# EAGLE design Power_ToOctoPi (EAGLE 8.4.0)
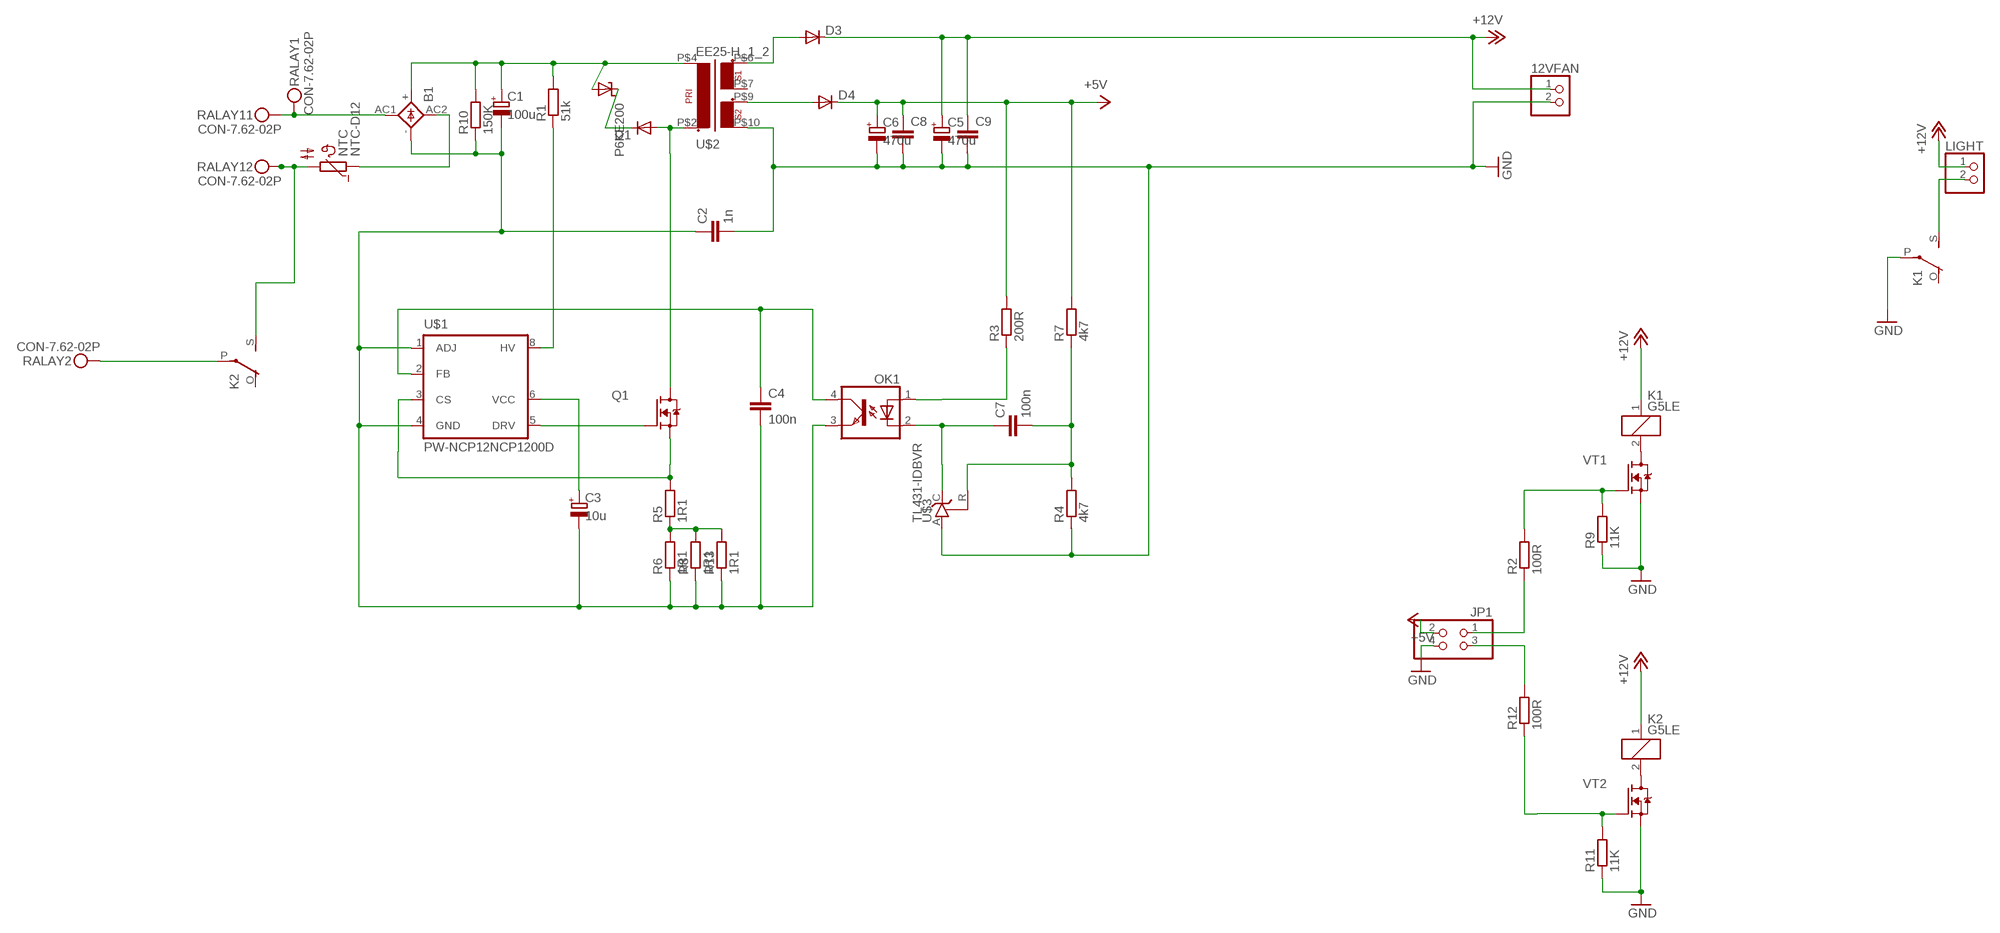
[diagram p0: schematic, sheet 1]

## Parts
12VFAN  PINHD-1X2  [1X02]
B1  KBL  [KBL]
C1  100u  CAP-POL_E25-10-C  [C_D25-G10-CLAMP]
C2  1n  CAP_C50-024X044  [C050-024X044]
C3  10u  CAP-POL_E2.5-7  [E2,5-7]
C4  100n  C-EUC1206  [C1206]
C5  470u  CAP-POL_E5-10.5  [E5-10,5]
C6  470u  CAP-POL_E5-10.5  [E5-10,5]
C7  100n  C-EUC1206  [C1206]
C8  CAP_0805  [C0805]
C9  CAP_0805  [C0805]
D1  DIODE_ES1J  [DO214AC]
D3  DIODE_ES1J  [DO214AC]
D4  DIODE_ES1J  [DO214AC]
JP1  PINHD-2X2  [2X02]
K1  G5LE  [G5LE]
K2  G5LE  [G5LE]
LIGHT  PINHD-1X2  [1X02]
NTC  NTC-D12  [NTC-D12]
OK1  OPTOTRANSPC817  [DIL04]
P6KE200  SUPRESSORDO-204AC  [DO15-12]
Q1  FET-NTO-220  [TO-220V]
R1  51k  R_SQP-5  [SQP-5]
R2  100R  R_0805  [R0805]
R3  200R  R-EU_R1206  [R1206]
R4  4k7  R-EU_R1206  [R1206]
R5  1R1  R-EU_R1206  [R1206]
R6  1R1  R-EU_R1206  [R1206]
R7  4k7  R-EU_R1206  [R1206]
R8  1R1  R-EU_R1206  [R1206]
R9  11K  R_0805  [R0805]
R10  150K  R_MF-0125  [MF-0125]
R11  11K  R_0805  [R0805]
R12  100R  R_0805  [R0805]
R13  1R1  R-EU_R1206  [R1206]
RALAY  CON-7.62-02P  [KF25C-7.62-02P-13]
RALAY1  CON-7.62-02P  [KF25C-7.62-02P-13]
U$1  PW-NCP12NCP1200D  [SO8]
U$2  EE25-H_1_2  [EE25]
U$3  TL431-IDBVR  [SOT23-5]
VT1  FET-NPF-6X5  [POWERFLAT-5X6]
VT2  FET-NPF-6X5  [POWERFLAT-5X6]

## Nets
+5V: C6.+ C8.1 D4.C JP1.2 R3.2 R7.2
+12V: 12VFAN.1 C5.+ C9.1 D3.C K1.1 K2.1 LIGHT.1
GND: 12VFAN.2 C2.2 C5.- C6.- C8.2 C9.2 JP1.4 K1.P(2:P) R4.1 R9.1 R11.1 U$2.P$10 U$3.A VT1.S1(S) VT1.S2(S) VT1.S3(S) VT2.S1(S) VT2.S2(S) VT2.S3(S)
N$1: K2.S(2:S) NTC.2 RALAY1.P$2
N$2: B1.AC1(AC2) RALAY1.P$1 RALAY.P$1
N$3: B1.AC2(AC1) NTC.1
N$4: R5.1 R6.2 R8.2 R13.2
N$5: B1.- C1.- C2.1 C3.- C4.2 OK1.3(EMIT) R6.1 R8.1 R10.1 R13.1 U$1.1(ADJ) U$1.4(GND)
N$6: B1.+ C1.+ P6KE200.A R1.2 R10.2 U$2.P$4
N$7: D1.C P6KE200.C
N$8: D1.A Q1.2(D) U$2.P$2
N$9: K1.2 VT1.D1(D)
N$10: R1.1 U$1.8(HV)
N$11: Q1.1(G) U$1.5(DRV)
N$12: Q1.3(S) R5.2 U$1.3(CS)
N$13: JP1.1 R2.1
N$14: C3.+ U$1.6(VCC)
N$15: C4.1 OK1.4(COL) U$1.2(FB)
N$17: D3.A U$2.P$6
N$18: JP1.3 R12.2
N$19: C7.2 R4.2 R7.1 U$3.R
N$20: OK1.1(A) R3.1
N$28: D4.A U$2.P$9
N$31: C7.1 OK1.2(C) U$3.C
N$34: R2.2 R9.2 VT1.G
N$35: R11.2 R12.1 VT2.G
N$36: K1.S(2:S) LIGHT.2
N$37: K2.2 VT2.D1(D)
N$38: K2.P(2:P) RALAY.P$2
Unconnected: K1.O(2:O) K2.O(2:O) U$2.P$7

## Library data of the parts
12VFAN LIGHT = pinhead:PINHD-1X2: PIN HEADER
B1 = rectifier:KBL: DIOTEC RECTIFIER
C1 C3 C5 C6 = Namenlos:CAP-POL_
C2 C8 C9 = Namenlos:CAP_
C4 C7 = rcl:C-EU: CAPACITOR, European symbol
D1 D3 D4 = Namenlos:DIODE_
JP1 = pinhead:PINHD-2X2: PIN HEADER
K1 K2 = relay:G5LE: RELAY 1 x switch, 10 A/120 V AC, 8 A/30 V DC, Omron; OC_FARNELL: unknown; OC_NEWARK: unknown
NTC = Namenlos:NTC-D12
OK1 = Namenlos:OPTOTRANS: SHARP OPTO COUPLER; MPN: PC817X4J000F; OC_FARNELL: 9707727; OC_NEWARK: 97K7059
P6KE200 = Namenlos:SUPRESSOR
Q1 VT1 VT2 = Namenlos:FET-N
R1 R2 R9-R12 = Namenlos:R_
R3-R8 R13 = rcl:R-EU_: RESISTOR, European symbol
RALAY RALAY1 = Namenlos:CON-7.62-02P
U$1 = Namenlos:PW-NCP12*
U$2 = EFD25:EE25-H_1_2
U$3 = TL431:TL431-IDBVR

## Board
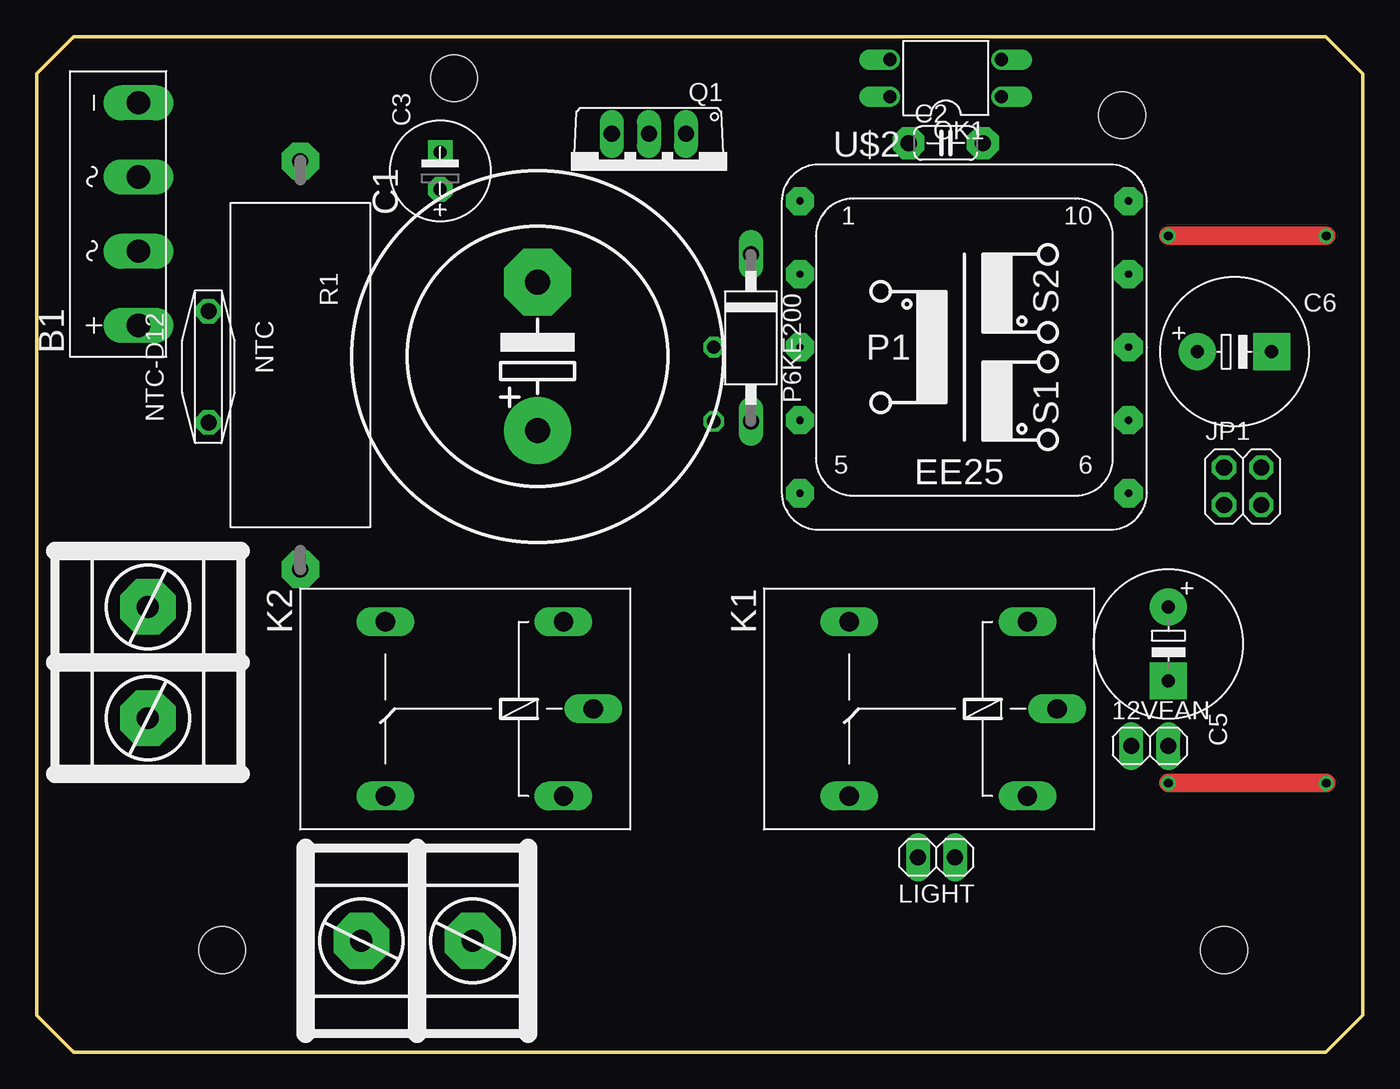
[diagram p1: board, top side]
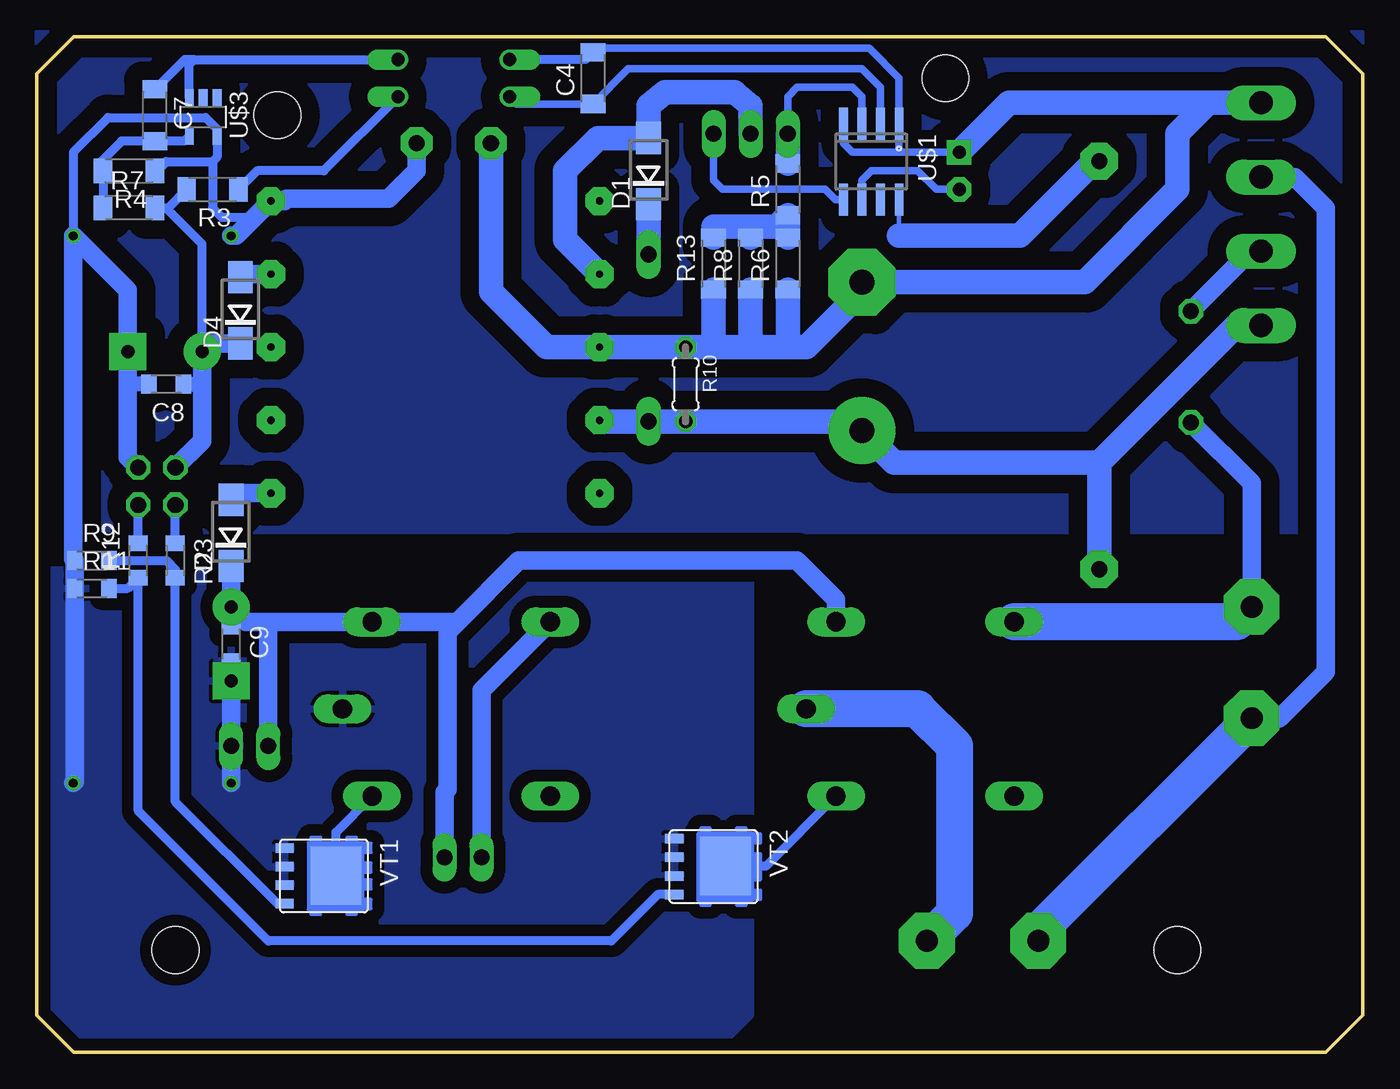
[diagram p2: board, bottom side, seen from below]

Size 90.78 x 69.52 mm. Coordinates in mm from the lower left corner, seen from the top.
Outline: 0,66.98 0,2.54 2.54,0 88.24,0 90.78,2.54 90.78,66.98 88.24,69.52 2.54,69.52 0,66.98
Copper layers (1*16): Top 0.035mm / dielectric 1.5mm / Bottom 0.035mm
Design rules "EagleDesignRules": minimum track width 0.2mm, minimum drill 0.3mm, track to track 0.2mm, track to pad 0.2mm, pad to pad 0.2mm, via to via 0.2mm, smd to smd 0.2mm, copper to edge 0.5mm, drill to drill 0.2mm, minimum pad ring 10mil, minimum via ring 8mil, stop-mask expansion 4mil, vias tented up to drill 0mil, thermal gap 0.25mm
Holes 3.2 mm at 74.3,64.13 28.57,66.67 12.7,6.98 81.28,6.98

### Footprints (pad centres in the part's own frame; a part is rotated, then mirrored left to right if it is on the bottom)
1X02 = drill 1.1 long: 1 -1.27,0; 2 1.27,0
KBL = drill 1.6 long: + -7.62,-1.27; - 7.62,-1.27; AC1 2.54,-1.27; AC2 -2.54,-1.27
C_D25-G10-CLAMP = drill 1.7 pad 4.597: + -5.08,0 | drill 1.7 pad 4.597 octagon: - 5.08,0
C050-024X044 = drill 1.1 pad 2.184 octagon: 1 -2.54,0; 2 2.54,0
E2,5-7 = drill 0.9 pad 1.676 octagon: + -1.27,0 | drill 0.9 pad 1.676 square: - 1.27,0
C1206 = smd 1.25 x 1.7: 1 -1.775,0; 2 1.775,0
E5-10,5 = drill 0.9 pad 2.54: + -2.54,0 | drill 0.9 pad 2.54 square: - 2.54,0
C0805 = smd 1.05 x 1.3: 1 -1.175,0; 2 1.175,0
DO214AC = smd 2.2 x 1.7: A 2.25,0; C -2.285,0
2X02 = drill 1.1 octagon: 1 -1.27,-1.27; 2 -1.27,1.27; 3 1.27,-1.27; 4 1.27,1.27
G5LE = drill 1.321 long: 1 -7.493,-5.969; 2 -7.493,5.969; O 4.699,5.969; P -9.525,0; S 4.699,-5.969
NTC-D12 = drill 1.1 pad 1.676 octagon: 1 -3.81,0; 2 3.81,0
DIL04 = drill 0.9 pad 1.27 offset: 1 -1.27,-3.81; 2 1.27,-3.81; 3 1.27,3.81; 4 -1.27,3.81
DO15-12 = drill 1.1 pad 1.676 long: A 5.08,0; C -6.35,0
TO-220V = drill 1.1 long: 1 -2.54,-2.54; 2 0,-2.54; 3 2.54,-2.54
SQP-5 = drill 1.1 pad 2.54 octagon: 1 -13.97,0; 2 13.97,0
R0805 = smd 1.05 x 1.3: 1 -1.175,0; 2 1.175,0
R1206 = smd 1.25 x 1.7: 1 -1.775,0; 2 1.775,0
MF-0125 = drill 0.9 octagon: 1 -2.54,0; 2 2.54,0
KF25C-7.62-02P-13 = drill 1.5 pad 3.81 octagon: P$1 -3.81,0; P$2 3.81,0
SO8 = smd 0.6 x 2.2: 1 -1.905,-2.6; 2 -0.635,-2.6; 3 0.635,-2.6; 4 1.905,-2.6; 5 1.905,2.6; 6 0.635,2.6; 7 -0.635,2.6; 8 -1.905,2.6
EE25 = drill 0.5 pad 1.93 octagon: P$1 -11.25,10; P$2 -11.25,5; P$3 -11.25,0; P$4 -11.25,-5; P$5 -11.25,-10; P$6 11.25,-10; P$7 11.25,-5; P$8 11.25,0; P$9 11.25,5; P$10 11.25,10
SOT23-5 = smd 0.6 x 1.2: + 0,-2.576; A -0.95,0.036; C 0.95,-2.576; NC -0.95,-2.576; R 0.95,0.036
POWERFLAT-5X6 = smd 4 x 3.5: D1 -0.03,0.83 | smd 0.65 x 1.25: G 1.905,-2.685; S1 -1.905,-2.685; S2 -0.635,-2.685; S3 0.635,-2.685

### Placement (x,y rotation side)
12VFAN  76.2,20.95 0 top
B1  5.71,57.37 90 top
C1  34.29,47.62 90 top
C2  62.23,62.23 0 top
C3  27.62,60.33 90 top
C4  52.71,66.67 90 bottom
C5  77.47,27.94 270 top
C6  81.99,47.95 0 top
C7  82.68,64.13 270 bottom
C8  81.91,45.72 180 bottom
C9  77.47,27.94 270 bottom
D1  48.9,60.33 90 bottom
D3  77.47,35.56 90 bottom
D4  76.83,50.8 90 bottom
JP1  82.55,38.73 0 top
K1  60.32,23.49 180 top
K2  28.57,23.49 180 top
LIGHT  61.6,13.33 180 top
NTC  11.77,46.91 270 top
OK1  62.23,66.67 90 top
P6KE200  48.9,48.26 270 top
Q1  41.91,60.33 180 top
R1  18.06,47.03 270 top
R2  81.28,33.66 270 bottom
R3  78.74,59.05 180 bottom
R4  84.45,60.33 180 bottom
R5  39.37,59.05 90 bottom
R6  39.37,53.97 90 bottom
R7  84.45,57.78 0 bottom
R8  41.91,53.97 90 bottom
R9  86.99,33.66 0 bottom
R10  46.36,45.72 270 bottom
R11  86.99,31.75 0 bottom
R12  83.82,33.66 90 bottom
R13  44.45,53.97 90 bottom
RALAY  26.04,7.62 0 top
RALAY1  7.62,26.67 90 top
U$1  33.66,60.96 180 bottom
U$2  63.5,48.26 0 top
U$3  79.38,62.74 180 bottom
VT1  71.12,12.06 270 bottom
VT2  44.45,12.7 270 bottom

### Tracks (layer width: path | path; a pad name or v marks a point on that pad's centre or on a via)
+5V
  Bottom 0.61: 81.91,57.78 R7.2 | 81.91,57.78 81.78,57.78 R3.2 | C6.+ 79.45,55.32 81.91,57.78
  Bottom 1.016: C8.1 79.45,45.72
  Bottom 1.27: D4.C 78.88,48.52 C6.+ 79.45,45.72 79.45,41.83 JP1.2
+12V
  Bottom 1.016: C9.1 C5.+
  Bottom 1.27: LIGHT.1 62.87,17.78 62.66,17.98 62.66,28.78 61.98,29.46 | K2.1 36.07,30.99 38.73,33.66 57.79,33.66 61.98,29.46 | 61.98,29.46 K1.1 74.93,29.46 | D3.C C5.+ 76.45,29.46 74.93,29.46 | 12VFAN.1 74.93,29.46
GND  (via drill 0.6)
  Top 1.27: v77.47,55.88 v88.27,55.88 | v88.27,18.41 v77.47,18.41
  Bottom 0.61: 78.74,60.96 78.42,61.27 U$3.A 78.42,63.19 79.22,63.98 85.88,63.98 88.27,61.59 v88.27,55.88 | 78.74,60.96 78.74,57.78 78.1,57.15 75.86,57.15 U$2.P$10 | R4.1 82.55,60.33 81.91,60.96 78.74,60.96
  Bottom 1.016: C8.2 84.53,45.72
  Bottom 1.27: C2.2 64.77,60.33 66.67,58.42 73.66,58.42 73.82,58.26 U$2.P$10 77.13,55.88 v77.47,55.88 | C5.- 12VFAN.2 v77.47,18.41 | JP1.4 84.53,40.72 84.53,45.72 C6.- 84.53,52.15 v88.27,55.88 88.27,33.75 R9.1 R11.1 88.17,18.51 v88.27,18.41
  pour Bottom (isolate 0.813): 41.91,33.02 90.8,33.02 90.8,2.54 88.27,0 44.45,0 41.91,2.54
N$1
  Bottom 1.27: RALAY1.P$2 7.62,38.95 NTC.2
  Bottom 2.54: RALAY1.P$2 8.64,29.46 K2.S
N$2
  Bottom 1.27: B1.AC1 4.66,59.91 2.54,57.78 2.54,26.03 5.72,22.86 RALAY1.P$1
  Bottom 2.54: RALAY.P$1 22.22,8.25 RALAY1.P$1
N$3
  Bottom 1.27: NTC.1 7.67,54.83 B1.AC2
N$4
  Bottom 1.676: R6.2 R5.1 40.14,56.52 41.91,56.52 | R13.2 44.45,56.52 41.91,56.52 | 41.91,56.52 R8.2
N$5
  Bottom 0.3: 13.33,62.86 12.7,62.86
  Bottom 0.406: 33.71,68.64 33.79,68.71
  Bottom 0.508: 31.75,61.59 C3.- | 31.75,61.59 34.93,61.59 35.56,62.23 U$1.4 | 31.75,61.59 U$1.1 31.75,66.67 33.71,68.64 | 33.79,68.71 52.45,68.71 C4.2
  Bottom 0.61: C4.2 53.21,67.94 OK1.3
  Bottom 1.676: B1.- 10.58,64.99 | 10.58,64.99 12.7,62.86 12.7,59.05 19.05,52.7 33.66,52.7 | 33.66,52.7 C1.- 34.8,52.2 | C3.- 24.23,64.99 10.58,64.99 | C2.1 59.69,52.07 55.88,48.26 R10.1 44.45,48.26 | 44.45,48.26 41.91,48.26 | 41.91,48.26 39.37,48.26 | 39.37,48.26 38.1,48.26 33.66,52.7 | R6.1 39.37,48.26 | R8.1 41.91,48.26 | R13.1 44.45,48.26
N$6
  Bottom 1.676: B1.+ 8.67,49.75 17.78,40.64 18.06,40.36 | 18.06,40.36 R1.2 | 18.06,40.36 32.11,40.36 C1.+ 34.93,43.18 46.99,43.18 | 46.99,43.18 P6KE200.A 52.17,43.18 U$2.P$4 | R10.2 46.99,43.18
N$7
  Bottom 1.676: P6KE200.C D1.C
N$8
  Bottom 1.676: Q1.2 41.91,64.77 43.02,65.72 47.78,65.72 48.9,64.77 D1.A 52.36,62.58 54.61,60.33 54.61,55.62 U$2.P$2
N$9
  Bottom 0.61: 68.38,16.96 K1.2 70.29,15.05 VT1.D1
N$10
  Bottom 0.3: 31.75,55.88 U$1.8
  Bottom 1.676: 31.75,55.88 31.11,55.88 23.49,55.88 18.38,61 R1.1
N$11
  Bottom 0.508: U$1.5 36.11,58.36 36.83,59.08 43.84,59.08 44.45,59.69 Q1.1
N$12
  Bottom 0.508: U$1.3 34.29,65.41 34.93,66.04 38.73,66.04 39.37,65.41 Q1.3
  Bottom 1.676: Q1.3 R5.2
N$13
  Bottom 0.61: R2.1 JP1.1
N$14
  Bottom 0.508: U$1.6 34.29,59.69 33.66,60.33 30.48,60.33 29.21,59.05 C3.+
N$15
  Bottom 0.508: U$1.2 33.02,66.04 34.29,67.31 50.3,67.31 C4.1 57.91,64.9 OK1.4
N$17
  Bottom 1.27: U$2.P$6 77.02,38.26 D3.A
N$18
  Bottom 0.61: R12.2 JP1.3
N$19
  Bottom 0.61: U$3.R 80.67,62.36 C7.2 84.96,62.36 86.36,60.96 86.36,60.45 R4.2 R7.1
N$20
  Bottom 0.61: OK1.1 71.12,60.33 75.69,60.33 R3.1
N$28
  Bottom 1.27: U$2.P$9 76.62,53.26 D4.A
N$30
  pour Bottom (isolate 1.27): 0,69.85 90.8,69.85 90.8,35.56 0,35.56
N$31
  Bottom 0.61: 80.01,67.94 OK1.2 | 80.01,67.94 80.64,67.94 C7.1 | U$3.C 80.32,67.63 80.01,67.94
N$34
  Bottom 0.61: R9.2 81.91,33.66 81.28,33.02 R2.2 81.28,17.14 74.3,10.16 VT1.G
N$35
  Bottom 0.61: R11.2 84.55,31.75 R12.1 83.82,16.51 74.93,7.62 51.44,7.62 48.26,10.79 VT2.G
N$36
  Bottom 1.27: 55.37,29.21 K1.S 60.32,24.77 LIGHT.2
N$37
  Bottom 0.61: K2.2 40.86,12.73 VT2.D1
N$38
  Bottom 2.54: RALAY.P$2 27.94,9.52 27.94,20.95 30.48,23.49 K2.P